# Altium schematic sheet PowerBoard.SchDoc
size Letter; Author: DMH; CompanyName: DETEX CORP; Engineer: DMH; Organization: DETEX CORP; Address1: 302 DETEX DR; Address2: NEW BRAUNFELS, TX; Revision: A0; SheetNumber: 1; SheetTotal: 1; ProjectName: DC-DC POWER BOARD
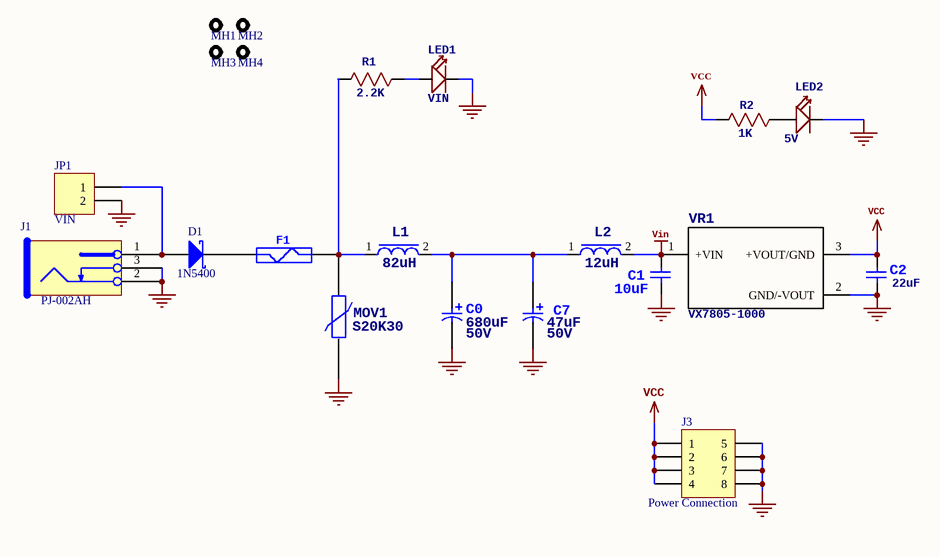
[diagram p0: PowerBoard.SchDoc]

## Parts
C0  value 680uF  Voltage: 50V  [PCBComponent_1]  (hidden comment: CAP_UC)
C1  10uF  [RES_0805]
C2  22uF  [RES_0805]
C7  Voltage: 50V  [PCBComponent_1]  (hidden comment: 47uF)
D1  1N5400  [DO-214AC]
F1  FUSE_5MM  [FUSE_5MM]  (value not drawn)
J1  PJ-002AH  [POWER_JACK_5.5_2.1MM_NS]
J3  Power Connection  [HDR2X4_CEN]
JP1  VIN  [HDR1X2]
L1  82uH  [CODACA_CSAB0630-100M_0]
L2  12uH  [INDUCTOR]
LED1  VIN  [LED-0805]
LED2  5V  [LED-0805]
MH1  Mounting Hole  [Mounting-Hole-RND-Altium]  (value not drawn)  (no BOM)
MH2  Mounting Hole  [Mounting-Hole-RND-Altium]  (value not drawn)  (no BOM)
MH3  Mounting Hole  [Mounting-Hole-RND-Altium]  (value not drawn)  (no BOM)
MH4  Mounting Hole  [Mounting-Hole-RND-Altium]  (value not drawn)  (no BOM)
MOV1  MFR P/N: S20K30  [MOV_7MM]  (hidden comment: MOV_7MM)
R1  2.2K  [RESC0805(2012)_M]
R2  1K  [RESC0805(2012)_M]
VR1  VX7805-1000  [VX7805-1000]

## Nets
GND: C0.2(MINUS) C1.2 C2.2 C7.2(MINUS) J1.2 J1.3 J3.5 J3.6 J3.7 J3.8 JP1.2 LED1.- LED2.- MOV1.2 VR1.2(GND/-VOUT)
VCC: C2.1 J3.1 J3.2 J3.3 J3.4 R2.2(R2) VR1.3(+VOUT/GND)
Vin: C1.1 L2.2 VR1.1(+VIN)
NetC0_1: C0.1(PLUS) C7.1(PLUS) L1.2 L2.1
NetD1_1: D1.1(A) J1.1 JP1.1
NetD1_2: D1.2(K) F1.1
NetF1_2: F1.2 L1.1 MOV1.1 R1.2(R2)
NetLED1_+: LED1.+ R1.1(R1)
NetLED2_+: LED2.+ R2.1(R1)

## Notes on the sheet
- Title
- Size:
- Date:
- Letter
- Number:
- Time:
- Revision:
- Sheet
- of
- File:

## Library data of the parts
C0 C7 = CAP_UC: CAP_UC_30D
  C7: Value: 47uF
C1 C2 = CAP_0805: 0805 SMD Ceramic Cap
  C1: Value: 10uF
  C2: Value: 22uF
D1 = D Schottky: Schottky Diode; Published: 8-Jun-2000; LatestRevisionDate: 17-Jul-2002; LatestRevisionNote: Re-released for DXP Platform.; PackageReference: SMB; Publisher: Altium Limited; PackageDescription: DO-214-AA/SMB; 2 C-Bend Leads; Body 5.3 x 3.6 mm, inc. leads (LxW); Code_JEDEC: DO-214-AA
J1 = PJ-002AH: CONN PWR JACK 2.1X5.5MM HIGH CUR; Manufacturer: CUI Inc; .Checked PCB: used; Mating connector: 2.1mm ID, 5.5mm OD; Gender: Male; Number of Positions/Contacts: 2 Conductors, 3 Contacts; Internal Switch(s): Single Switch, Normally Closed; Shielding: Unshielded; Voltage - Rated: 24VDC; Current Rating: 5A; .Checked SCH: used; Category: Connectors, Interconnects; Family: Barrel - Power; Manufacturer Part Number: PJ-002AH; Operating Temperature: -25°C ~ 85°C; Price 1k [$]: 0.23625; Supplier: Digikey; Supplier Part Number: CP-002AH-ND; Value: PJ-002AH; Supplier 1: Digi-Key; Supplier Part Number 1: CP-002AH-ND; RoHS: RoHS Compliant; Stock 1: 138933; Pricing 1: 1=1.01, 10=0.704, 100=0.4724, 500=0.3819, 1000=0.3417, 2500=0.27135 (USD); Connector Type: Jack; Plug/Mating Plug Diameter: 2.1mm ID, 5.5mm OD; Mounting Type: Through Hole, Right Angle; Termination: Solder Eyelet(s); Features: -; Color: Black; Contact Material: Copper Alloy; Contact Material - Plating: Nickel; Housing Color: Black; Housing Material: Thermoplastic; ComponentLink1URL: http://products.cui.com/GetSpecForDigiKey.aspx?MFGNum=PJ-002AH; ComponentLink1Description: http://products.cui.com/GetSpecForDigiKey.aspx?MFGNum=PJ-002AH
J3 = Header 4X2A: Header, 4-Pin, Dual row; LatestRevisionDate: 17-Jul-2002; LatestRevisionNote: Re-released for DXP Platform.; Publisher: Altium Limited
JP1 = Header 2: Header, 2-Pin; LatestRevisionDate: 17-Jul-2002; LatestRevisionNote: Re-released for DXP Platform.; Publisher: Altium Limited
L1 L2 = CSAB0630-100M: Part Number: CSAB0630-100M
LED1 LED2 = SMD-LED-CLEAR-RED(0805): MPN: 17-215SURC/S530-A2/TR8
MOV1 = MOV_7MM: Value: {Value}
R1 R2 = MCPWR05FTEW2005: POWERRATING: 125mW; TOLERANCE: ± 1%; MPN: MCPWR05FTEW2005; OC_FARNELL: 1887395; OC_NEWARK: 43T5453; SUPPLIER: MULTICOMP
VR1 = VX7805-1000: 1 A Output Current, 6~36 Vdc Input, 3 Pin SIP, Non-Isolated, Dc-Dc Converter; MF: CUI Inc.; SnapEDA_Link: https://www.snapeda.com/parts/VX7805-1000/CUI%20Inc./view-part/?ref=snap; Digi-Key_Purchase_URL: https://www.digikey.com/product-detail/en/cui-inc/VX7805-1000/102-4253-ND/7350292?utm_source=snapeda&utm_medium=aggregator&utm_campaign=symbol; MP: VX7805-1000; Package: SIP-3 CUI; CUI_purchase_URL: https://www.cui.com/product/dc-dc-converters/non-isolated/vx78-1000-series?utm_source=snapeda.com&utm_medium=referral&utm_campaign=snapedaBOM; Digi-Key_Part_Number: 102-4253-ND; Value: *; ComponentLink1Description: Datasheet; ComponentLink1URL: https://www.cui.com/product/resource/vx78-1000.pdf
F1 = FUSE_5MM: Value: *